# EAGLE design Linear Slider (EAGLE 6.4)
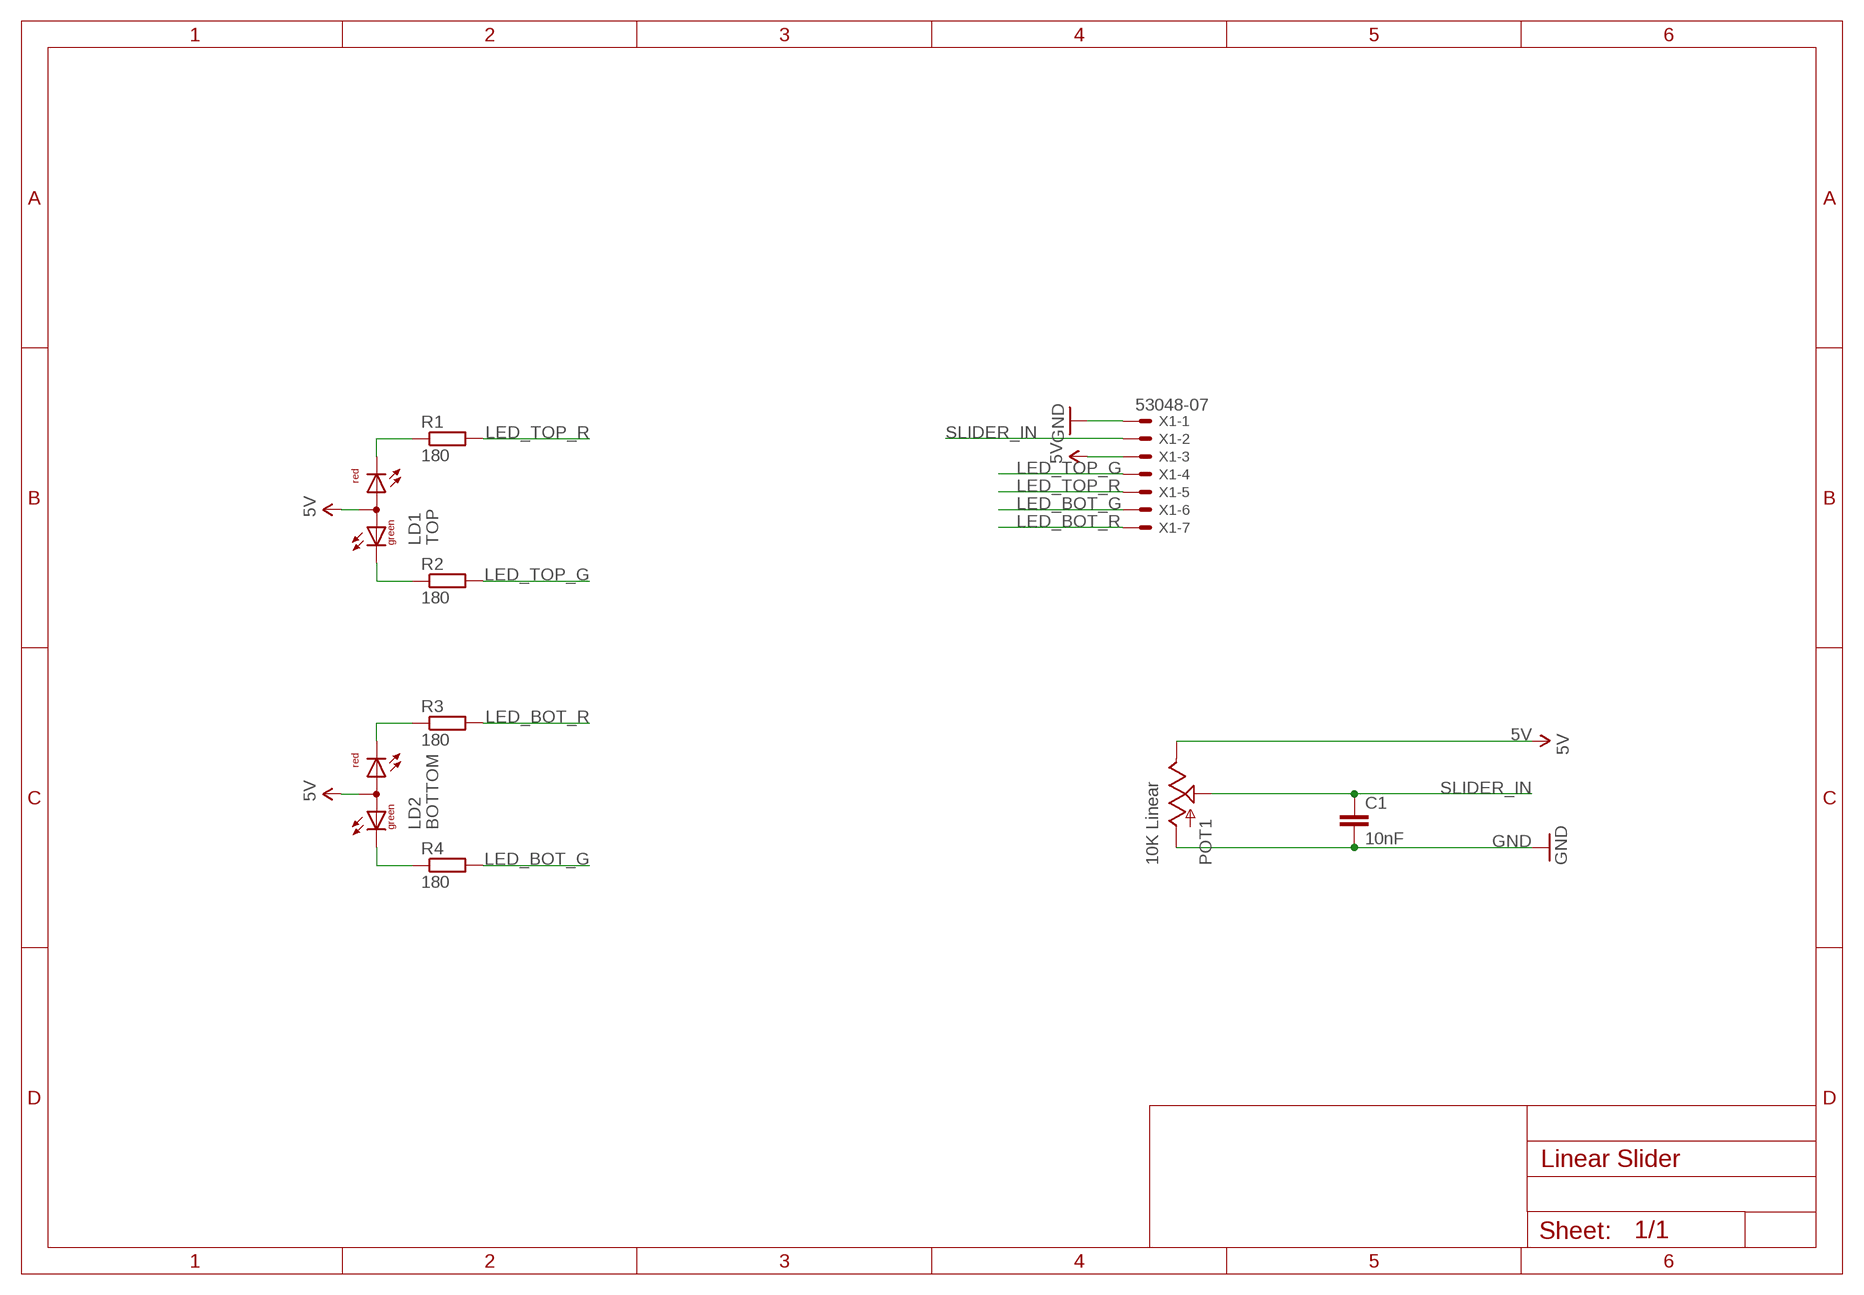
[diagram p0: schematic, sheet 1]

## Parts
C1  10nF  CAP0603-CAP  [0603-CAP]
LD1  TOP  DUOLED-RG-A  [DUOLED-A-5MM]
LD2  BOTTOM  DUOLED-RG-A  [DUOLED-A-5MM]
POT1  10K Linear  SLIDER60  [SLIDER60]
R1  180  R-EU_R0603  [R0603]
R2  180  R-EU_R0603  [R0603]
R3  180  R-EU_R0603  [R0603]
R4  180  R-EU_R0603  [R0603]
X1  53048-07  [53048-07]

## Nets
5V [Power]: LD1.A LD2.A POT1.1(E) X1.3
GND [Power]: C1.2 POT1.3(A) X1.1
LED_BOT_G: R4.2 X1.6
LED_BOT_R: R3.2 X1.7
LED_TOP_G: R2.2 X1.4
LED_TOP_R: R1.2 X1.5
N$1: LD1.CR R1.1
N$2: LD1.CX(CG) R2.1
N$3: LD2.CX(CG) R4.1
N$4: LD2.CR R3.1
SLIDER_IN: C1.1 POT1.2A(S) X1.2

## Library data of the parts
C1 = SparkFun:CAP: Capacitor Standard 0603 ceramic capacitor, and 0.1" leaded capacitor.
LD1 LD2 = led:DUOLED-RG-A: DUO LED 2 colors (red/green), 5 mm, round, common Anode www.ligitek.com or other producers.
POT1 = SKAARHOJ:SLIDER
R1-R4 = resistor:R-EU_: RESISTOR, European symbol
X1 = con-molex:53?-07: CONNECTOR wire to board 1.25 mm (.049 inch) pitch header; MPN: 53048-0710; OC_FARNELL: 9732934; OC_NEWARK: 98K9835

## Net classes
0 default: width 0.203 mm, drill 0.406 mm, clearance 0.203 mm
1 Power: width 0.406 mm, drill 0.61 mm, clearance 0.203 mm

## Board
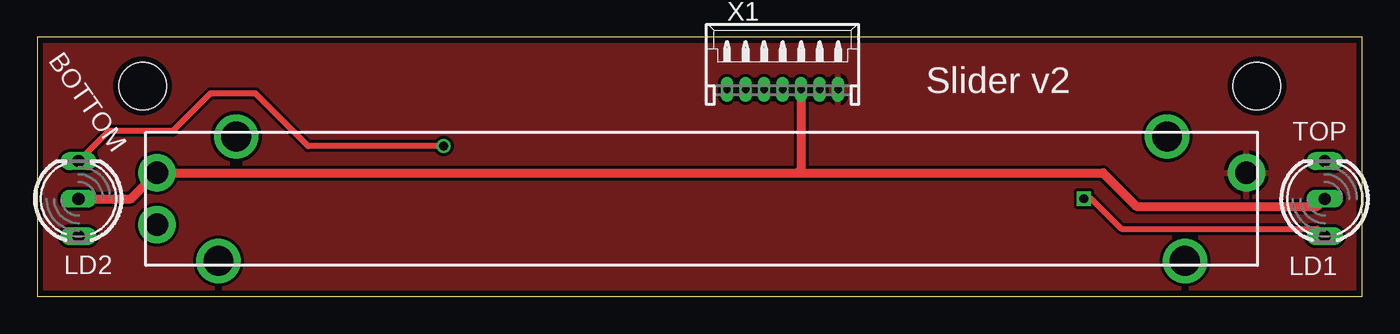
[diagram p1: board, top side]
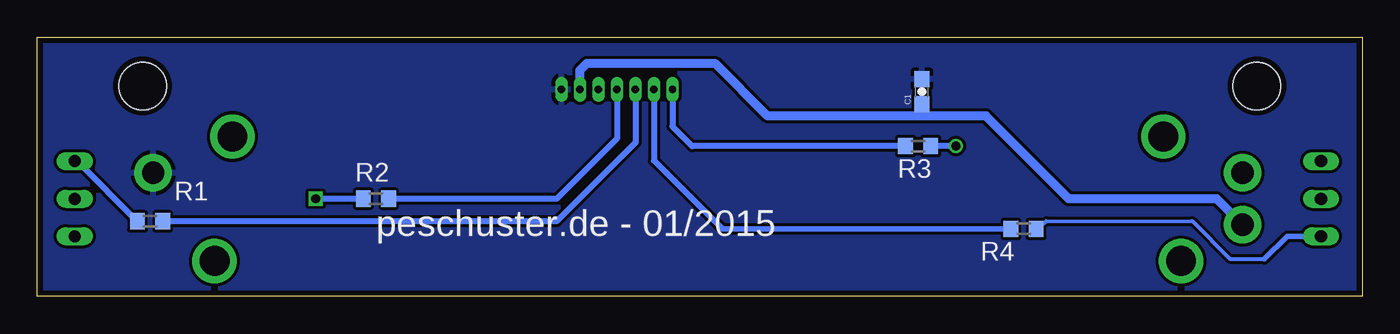
[diagram p2: board, bottom side, seen from below]

Size 89.41 x 17.53 mm. Coordinates in mm from the lower left corner, seen from the top.
Outline: 0,0 89.41,0 89.41,17.53 0,17.53 0,0
Copper layers (1*16): Top 0.0356mm / dielectric 1.5011mm / Bottom 0.0356mm
Design rules "OshPark_PCBOrder": minimum track width 6mil, minimum drill 13mil, track to track 6mil, track to pad 6mil, pad to pad 6mil, via to via 6mil, smd to smd 6mil, copper to edge 15mil, drill to drill 6mil, minimum pad ring 7mil, minimum via ring 7mil, stop-mask expansion 4mil, vias tented up to drill 0mil, thermal gap 10mil
Holes 3.2 mm at 7.11,14.22 82.3,14.22

### Footprints (pad centres in the part's own frame; a part is rotated, then mirrored left to right if it is on the bottom)
0603-CAP = smd 1.1 x 1: 1 -0.85,0; 2 0.85,0
DUOLED-A-5MM = drill 0.813 long: A 0,0; CR 2.54,0; CX -2.54,0
SLIDER60 = drill 1.5 pad 2.54: 1 -36.75,1.75; 2A -36.75,-1.75; 3 36.75,1.75 | drill 2: P$1 -31.4,4.2; P$2 31.4,4.2; P$3 32.6,-4.2; P$4 -32.6,-4.2
R0603 = smd 1 x 1.1: 1 -0.85,0; 2 0.85,0
53048-07 = drill 0.5 pad 0.698 long: 1 3.75,-1.25; 2 2.5,-1.25; 3 1.25,-1.25; 4 0,-1.25; 5 -1.25,-1.25; 6 -2.5,-1.25; 7 -3.75,-1.25

### Placement (x,y rotation side)
C1  29.72,13.84 90 bottom
LD1  86.87,6.6 90 top
LD2  2.79,6.6 90 top
POT1  44.83,6.6 0 top
R1  81.79,5.08 0 bottom
R2  66.55,6.6 0 bottom
R3  29.97,10.16 180 bottom
R4  22.86,4.57 180 bottom
X1  50.29,15.24 0 top

### Tracks (layer width: path | path; a pad name or v marks a point on that pad's centre or on a via)
5V
  Top 0.61: LD2.A 6.33,6.6 POT1.1 51.31,8.35 | 51.31,8.35 71.91,8.35 74.17,6.1 86.36,6.1 LD1.A | X1.3 51.54,8.59 51.31,8.35
GND
  pour Top: -3.05,-0.51 -3.05,18.03 94.74,18.03 94.74,-1.02
  pour Bottom: -3.05,0 -3.05,17.27 94.74,17.27 94.23,-0.51
LED_BOT_G
  Bottom 0.356: 47.5,8.89 47.24,8.64 43.18,4.57 R4.2
  Bottom 0.406: X1.6 47.79,9.18 47.24,8.64
LED_BOT_R
  Bottom 0.406: R3.2 45.21,10.16 46.54,11.49 X1.7
LED_TOP_G
  Bottom 0.406: R2.2 54.36,6.6 50.29,10.67 X1.4
LED_TOP_R  (1 unrouted)
  Bottom 0.406: R1.2 54.36,5.08 49.02,10.41 49.02,13.97
N$1
  Bottom 0.406: R1.1 86.7,9.14 LD1.CR
N$2  (via drill 0.6)
  Top 0.406: v70.61,6.6 71.12,6.6 73.15,4.57 86.36,4.57 LD1.CX
  Bottom 0.406: R2.1 v70.61,6.6
N$3
  Bottom 0.254: R4.1 21.34,5.08 11.48,5.1 8.94,2.56 6.6,2.54
  Bottom 0.356: 6.6,2.54 5.08,4.06 LD2.CX
N$4  (via drill 0.6)
  Top 0.406: v27.43,10.16 18.29,10.16 14.73,13.72 11.68,13.72 9.14,11.18 4.83,11.18 LD2.CR
  Bottom 0.406: v27.43,10.16 R3.1
SLIDER_IN
  Bottom 0.61: POT1.2A 9.83,6.6 19.81,6.6 25.4,12.19 29.72,12.19 | 29.72,12.19 40.13,12.19 43.69,15.75 52.32,15.75 52.79,15.28 X1.2 | C1.1 29.72,12.19

### Text on the board
tNames: Slider v2
bNames: peschuster.de - 01/2015